# EAGLE design Badge_Fancy (EAGLE 6.3)
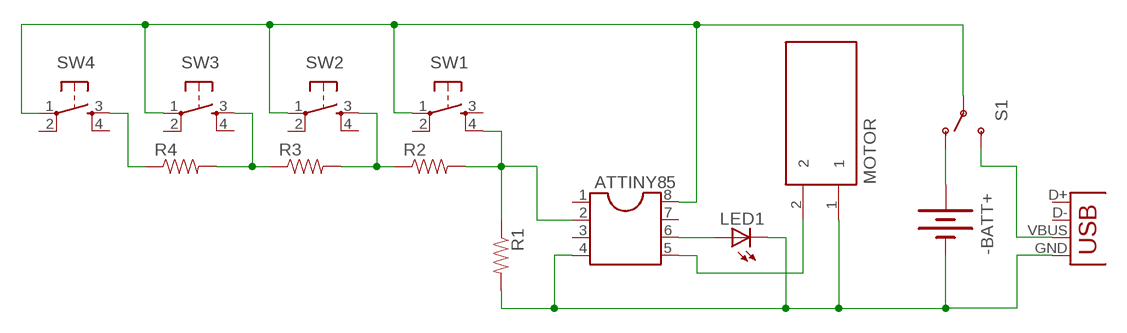
[diagram p0: schematic, sheet 1]

## Parts
-BATT+  BATTERY245MM  [BATTCON_245MM]
ATTINY85  DIL8S  [SOCKET-08]
LED1  LEDCHIPLED_0805  [CHIPLED_0805]
MOTOR  VIB-MOTOR  [VIB-MOTOR]
R1  RESISTOR2010  [R2010]
R2  RESISTOR2010  [R2010]
R3  RESISTOR2010  [R2010]
R4  RESISTOR2010  [R2010]
S1  SWITCH-SPSTSMD  [AYZ0202]
SW1  TAC_SWITCHPTH  [TACTILE-PTH]
SW2  TAC_SWITCHPTH  [TACTILE-PTH]
SW3  TAC_SWITCHPTH  [TACTILE-PTH]
SW4  TAC_SWITCHPTH  [TACTILE-PTH]
X2  USBSMD  [USB-MINIB]

## Nets
+3V: ATTINY85.8 S1.2(P) SW1.1 SW2.1 SW3.1 SW4.1
GND: -BATT+.2(-) ATTINY85.4 LED1.C MOTOR.1 R1.2 X2.GND
N$1: ATTINY85.5 MOTOR.2
N$2: -BATT+.1(+) S1.1(O)
N$3: S1.3(S) X2.VBUS
N$4: ATTINY85.2 R1.1 R2.2 SW1.4
N$5: ATTINY85.6 LED1.A
N$17: R4.1 SW4.3
N$18: R3.1 R4.2 SW3.3
N$19: R2.1 R3.2 SW2.3
Unconnected: ATTINY85.1 ATTINY85.3 ATTINY85.7 SW1.2 SW1.3 SW2.2 SW2.4 SW3.2 SW3.4 SW4.2 SW4.4 X2.D+ X2.D-

## Library data of the parts
-BATT+ = SparkFun:BATTERY: Battery Holders Various common sizes : AA, AAA, 20mm coin cell and 12mm coin cell.
ATTINY85 = ic-package:DIL8: Dual In Line / Socket
LED1 = led:LED: LED OSRAM: - CHIPLED LG R971, LG N971, LY N971, LG Q971, LY Q971, LO R971, LY R971 LH N974, LH R974 LS Q976, LO Q976, LY Q976 LO Q996 - Hyper CHIPLED LW Q18S LB Q993, LB Q99A, LB R99A - SideLED LS A670, LO A670, LY A670, LG A670, LP A670 LB A673, LV A673, LT A673, LW A673 LH A674 LY A675 LS A676, LA A676, LO A676, LY A676, LW A676 LS A679, LY A679, LG A679 - Hyper Micro SIDELED® LS Y876, LA Y876, LO Y876, LY Y876 LT Y87S - SmartLED LW L88C, LW L88S LB L89C, LB L89S, LG L890 LS L89K, LO L89K, LY L89K LS L896, LA L896, LO L896, LY L896 - TOPLED LS T670, LO T670, LY T670, LG T670, LP T670 LSG T670, LSP T670, LSY T670, LOP T670, LYG T670 LG T671, LOG T671, LSG T671 LB T673, LV T673, LT T673, LW T673 LH T674 LS T676, LA T676, LO T676, LY T676, LB T676, LH T676, LSB T676, LW T676 LB T67C, LV T67C, LT T67C, LS T67K, LO T67K, LY T67K, LW E67C LS E67B, LA E67B, LO E67B, LY E67B, LB E67C, LV E67C, LT E67C LW T67C LS T679, LY T679, LG T679 LS T770, LO T770, LY T770, LG T770, LP T770 LB T773, LV T773, LT T773, LW T773 LH T774 LS E675, LA E675, LY E675, LS T675 LS T776, LA T776, LO T776, LY T776, LB T776 LHGB T686 LT T68C, LB T68C - Hyper Mini TOPLED® LB M676 - Mini TOPLED Santana® LG M470 LS M47K, LO M47K, LY M47K Source: http://www.osram.convergy.de LUXEON: - LUMILED® LXK2-PW12-R00, LXK2-PW12-S00, LXK2-PW14-U00, LXK2-PW14-V00 LXK2-PM12-R00, LXK2-PM12-S00, LXK2-PM14-U00 LXK2-PE12-Q00, LXK2-PE12-R00, LXK2-PE12-S00, LXK2-PE14-T00, LXK2-PE14-U00 LXK2-PB12-K00, LXK2-PB12-L00, LXK2-PB12-M00, LXK2-PB14-N00, LXK2-PB14-P00, LXK2-PB14-Q00 LXK2-PR12-L00, LXK2-PR12-M00, LXK2-PR14-Q00, LXK2-PR14-R00 LXK2-PD12-Q00, LXK2-PD12-R00, LXK2-PD12-S00 LXK2-PH12-R00, LXK2-PH12-S00 LXK2-PL12-P00, LXK2-PL12-Q00, LXK2-PL12-R00 Source: www.luxeon.com KINGBRIGHT: KA-3528ASYC Source: www.kingbright.com
MOTOR = JeffThompson:VIB-MOTOR
R1-R4 = SparkFun:RESISTOR: Resistor Basic schematic elements and footprints for 0603, 1206, and PTH resistors.
S1 = SparkFun:SWITCH-SPST: SPST Switch Simple slide switch. Spark Fun Electronics SKU : COM-00102
SW1-SW4 = SparkFun:TAC_SWITCH: Momentary Switch Button commonly used for reset or general input. Spark Fun Electronics SKU : COM-00097
X2 = SparkFun:USB: USB Connectors USB-B-PTH is fully proven SKU : PRT-00139 USB-miniB is fully proven SKU : PRT-00587 USB-A-PCB is untested. USB-A-H is throughly reviewed, but untested. Spark Fun Electronics SKU : PRT-00437 USB-B-SMT is throughly reviewed, but untested. Needs silkscreen touching up. USB-A-S has not been used/tested USB-MB-H has not been used/tested

## Board
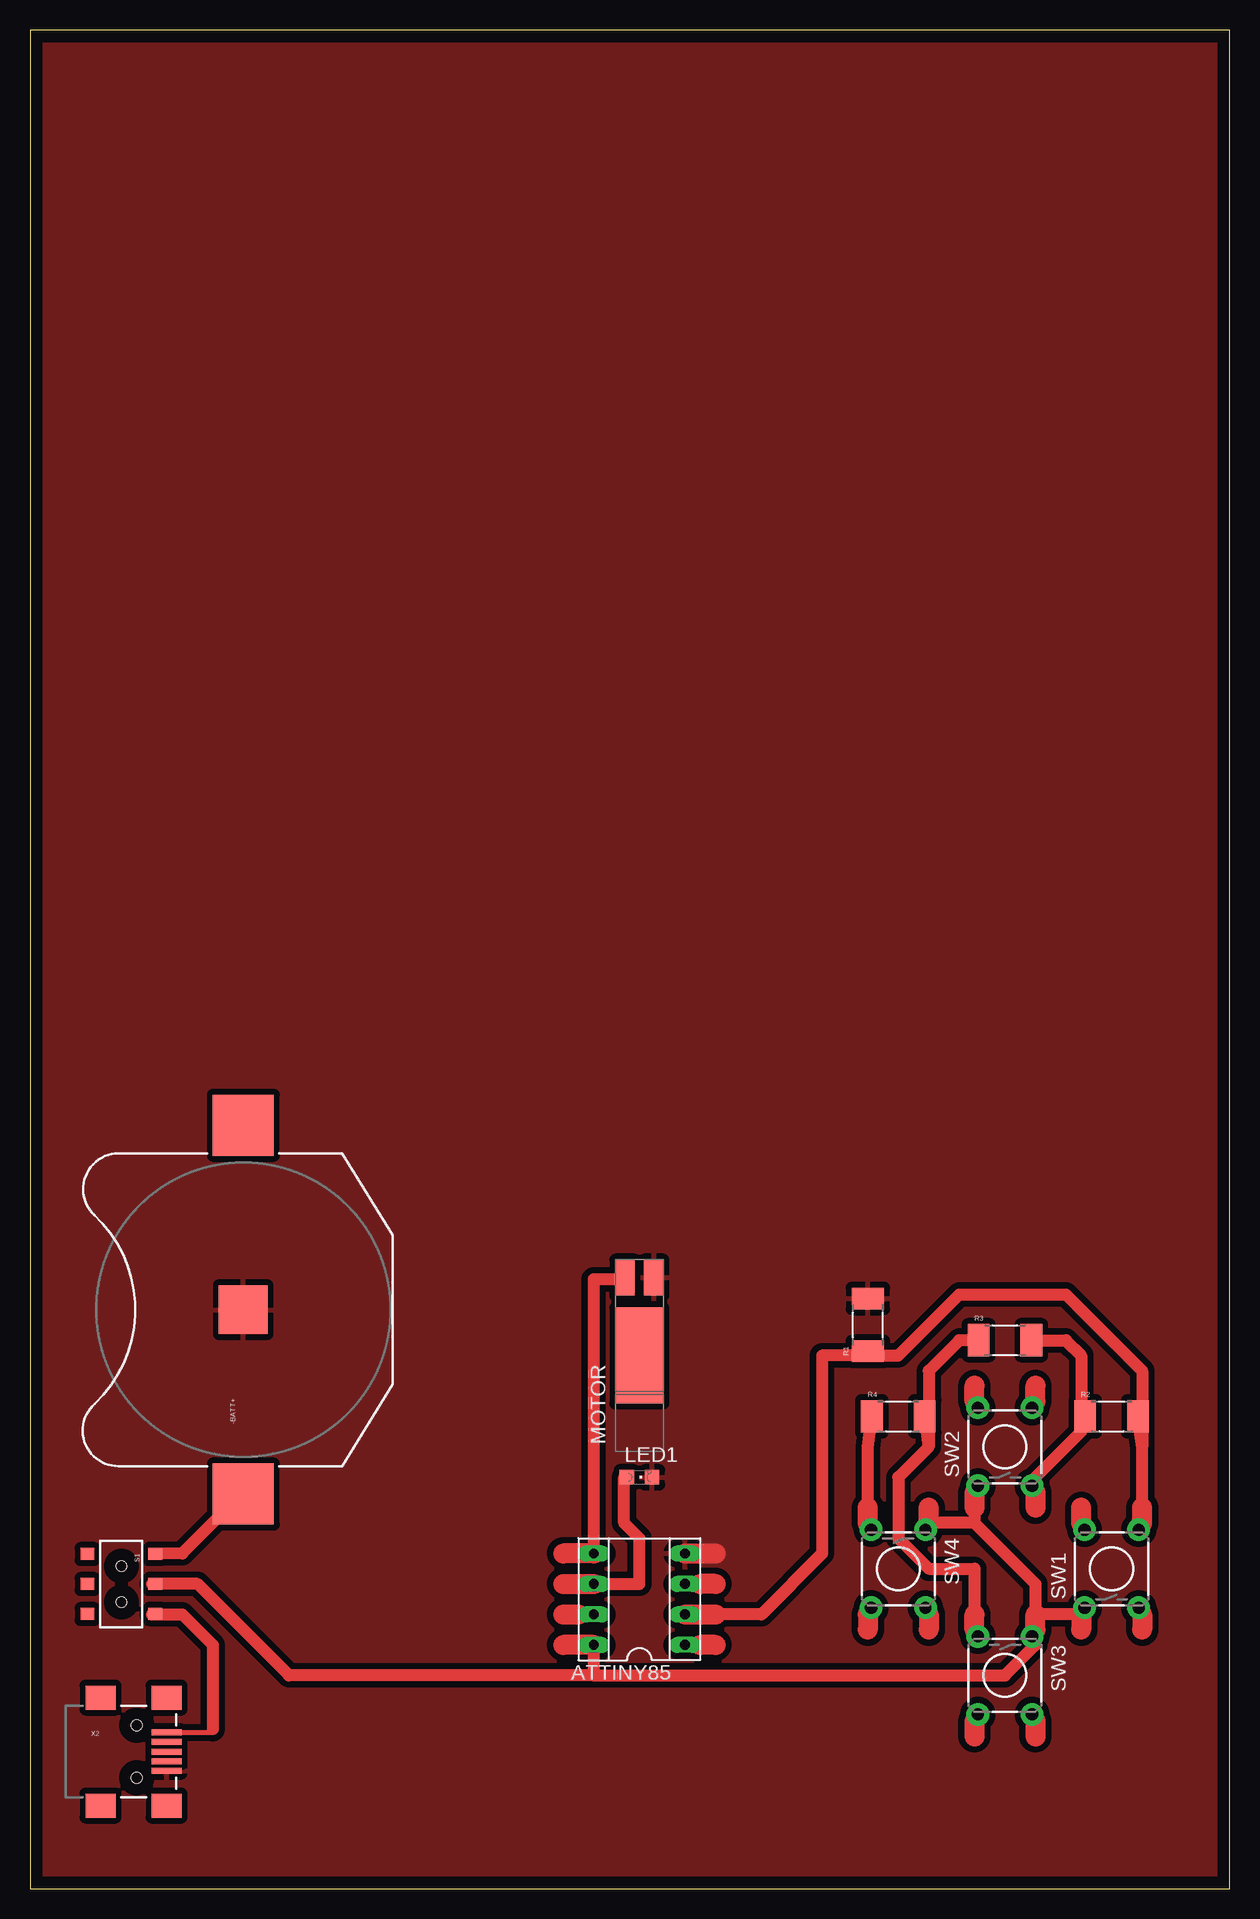
[diagram p1: board, top side]

Size 100 x 154.93 mm. Coordinates in mm from the lower left corner, seen from the top.
Outline: 0,0 100,0 100,154.93 0,154.93 0,0
Copper layers (1*16): Top 0.035mm / dielectric 1.5mm / Bottom 0.035mm
Design rules "Basic_Fall2012 *": minimum track width 40mil, minimum drill 24mil, track to track 20mil, track to pad 20mil, pad to pad 20mil, via to via 20mil, smd to smd 20mil, copper to edge 40mil, drill to drill 8mil, minimum pad ring 10mil, minimum via ring 8mil, stop-mask expansion 4mil, vias tented up to drill 0mil, thermal gap 20mil

### Footprints (pad centres in the part's own frame; a part is rotated, then mirrored left to right if it is on the bottom)
BATTCON_245MM = smd 5.08 x 5.08: 1 -15.367,0; 3 15.367,0 | smd 4.064 x 4.064: 2 0,0
SOCKET-08 = drill 0.813 long: 1 -3.81,-3.81; 2 -1.27,-3.81; 3 1.27,-3.81; 4 3.81,-3.81; 5 3.81,3.81; 6 1.27,3.81; 7 -1.27,3.81; 8 -3.81,3.81
CHIPLED_0805 = smd 1.2 x 1.2: A 0,-1.05; C 0,1.05
VIB-MOTOR = smd 3 x 1.6: 1 6.5,-1.2; 2 6.5,1.2 | smd 8 x 4: GROUND-PAD 0,0
R2010 = smd 1.8 x 2.7: 1 -2.2,0; 2 2.2,0
AYZ0202 = smd 1 x 1.15: 1 -2.5,2.825; 2 0,2.825; 3 2.5,2.825; 4 -2.5,-2.825; 5 0,-2.825; 6 2.5,-2.825 | hole 0.85: 1.5,0; -1.5,0
TACTILE-PTH = drill 1.016 pad 1.88: 1 -3.251,2.261; 2 3.251,2.261; 3 -3.251,-2.261; 4 3.251,-2.261
USB-MINIB = smd 2.5 x 0.5: D+ 2.5,0; D- 2.5,0.8; GND 2.5,-1.6; ID 2.5,-0.8; VBUS 2.5,1.6 | smd 2.5 x 2: MTN1 -3,4.5; MTN2 2.5,4.5; MTN3 -3,-4.5; MTN4 2.5,-4.5 | hole 0.9: 0,2.2; 0,-2.2

### Placement (x,y rotation side)
-BATT+  17.78,48.26 90 top
ATTINY85  50.8,24.13 90 top
LED1  50.8,34.29 270 top
MOTOR  50.8,44.45 90 top
R1  69.85,46.99 90 top
R2  90.17,39.37 0 top
R3  81.28,45.72 0 top
R4  72.39,39.37 0 top
S1  7.62,25.4 270 top
SW1  90.17,26.67 90 top
SW2  81.28,36.83 90 top
SW3  81.28,17.78 270 top
SW4  72.39,26.67 270 top
X2  8.89,11.43 0 top

### Tracks (layer width: path | path; a pad name or v marks a point on that pad's centre or on a via)
+3V
  Top 1.016: 83.82,21.59 SW3.1 83.82,20.32 81.28,17.78 46.99,17.78 | SW1.1 87.63,22.86 83.82,22.86 83.82,25.4 78.74,30.48 | 78.74,31.75 78.74,30.48 | 78.74,30.48 74.93,30.48 SW4.1 | 78.74,33.02 SW2.1 | 46.99,17.78 21.59,17.78 13.97,25.4 S1.2 10.16,25.4 | ATTINY85.8 46.99,17.78
  Top 1.676: 74.93,30.48 74.93,31.75 | 83.82,21.59 83.82,22.86 | 87.63,22.86 87.63,21.59 | 78.74,33.02 78.74,31.75 | ATTINY85.8 44.45,20.32
GND
  Top 1.676: ATTINY85.4 57.15,27.94
  pour Top: -1.27,156.21 101.6,156.21 101.6,-1.27 -1.27,-1.27
N$1
  Top 1.016: ATTINY85.5 46.99,50.8 49.53,50.8 MOTOR.2
  Top 1.676: ATTINY85.5 44.45,27.94
N$2
  Top 1.016: S1.1 12.7,27.94 17.78,33.02 -BATT+.1
N$3
  Top 0.406: X2.VBUS 15.24,13.03 15.24,13.3 | 12.7,22.86 10.45,22.86 S1.3
  Top 1.016: 10.16,22.86 12.7,22.86 15.24,20.32 15.24,13.3
N$4
  Top 1.016: 92.71,31.75 92.71,36.83 | 92.71,30.48 SW1.4 | 57.15,22.86 60.96,22.86 66.04,27.94 66.04,44.45 69.85,44.45 | 92.71,36.83 92.71,43.18 86.36,49.53 77.47,49.53 72.39,44.45 69.85,44.45 | 92.71,36.83 R2.2 | 69.85,44.45 R1.1
  Top 1.676: 92.71,30.48 92.71,31.75 | ATTINY85.2 57.15,22.86
N$5
  Top 1.016: ATTINY85.6 50.8,25.4 50.8,29.21 49.53,30.48 49.53,34.29 LED1.A
  Top 1.676: 44.45,25.4 ATTINY85.6
N$6
  Top 1.676: 69.85,22.86 69.85,21.59
N$7
  Top 1.676: 74.93,22.86 74.93,21.59
N$8
  Top 1.676: 92.71,22.86 92.71,21.59
N$9
  Top 1.676: 83.82,13.97 83.82,12.7
N$10
  Top 1.676: 78.74,13.97 78.74,12.7
N$11
  Top 1.676: 87.63,30.48 87.63,31.75
N$12
  Top 1.676: 83.82,33.02 83.82,31.75
N$13
  Top 1.676: 78.74,40.64 78.74,41.91
N$14
  Top 1.676: 83.82,40.64 83.82,41.91
N$15
  Top 1.676: 44.45,22.86 45.72,22.86
N$16
  Top 1.676: 57.15,25.4 55.88,25.4
N$17
  Top 1.016: 69.85,31.75 69.85,36.83 R4.1 | 69.85,30.48 SW4.3
  Top 1.676: 69.85,30.48 69.85,31.75
N$18
  Top 1.016: 74.93,36.83 74.93,43.18 77.47,45.72 R3.1 | 78.74,22.86 78.74,26.67 74.93,26.67 72.39,29.21 72.39,34.29 74.93,36.83 | 78.74,21.59 SW3.3 | 74.93,36.83 R4.2
  Top 1.676: 78.74,21.59 78.74,22.86
N$19
  Top 1.016: 87.63,38.1 87.63,44.45 86.36,45.72 R3.2 | 87.63,38.1 83.82,34.29 SW2.3 | 87.63,38.1 R2.1
N$20
  Top 1.676: 57.15,20.32 55.88,20.32